# Altium schematic sheet USB_TTL.SchDoc
size A4; SheetNumber: 6; SheetTotal: 6
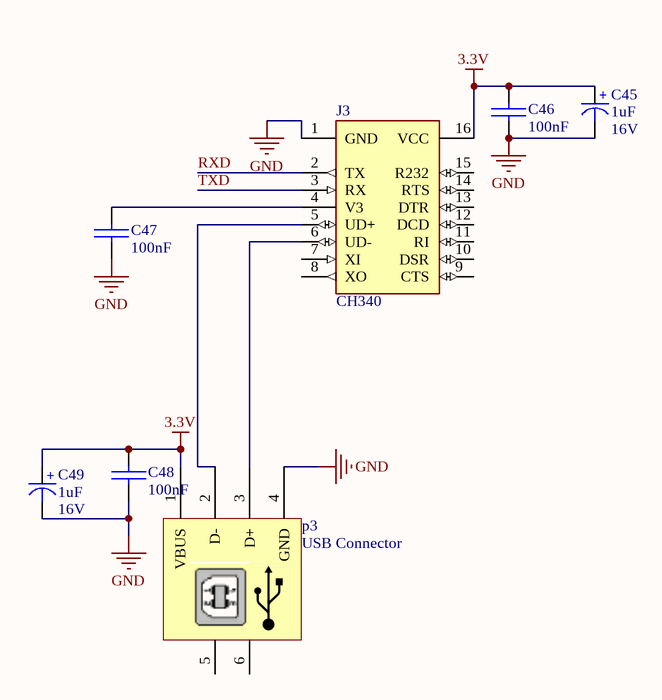
[diagram p0: USB_TTL.SchDoc]

## Parts
C45  Voltage: 16V  [cap 01]  (hidden comment: 1uF)
C46  100nF  [SMD_CAP_1206]
C47  100nF  [SMD_CAP_1206]
C48  100nF  [SMD_CAP_1206]
C49  Voltage: 16V  [cap 01]  (hidden comment: 1uF)
J3  CH340  [SOIC16]
p3  USB Connector  [USB2.5-2H4F]

## Nets
3.3V: C45.1(+) C46.1(+) C48.1(+) C49.1(+) J3.16(VCC) p3.1(VBUS)
GND: C45.2(-) C46.2(-) C47.2(-) C48.2(-) C49.2(-) J3.1(GND) p3.4(GND)
RXD: J3.2(TX)
TXD: J3.3(RX)
NetC47_1: C47.1(+) J3.4(V3)
NetJ3_5: J3.5(UD+) p3.2(D-)
NetJ3_6: J3.6(UD-) p3.3(D+)

Not connected (* = marked no-connect by the designer): J3 7(XI) 8(XO) 9(CTS) 10(DSR) 11(RI) 12(DCD) 13(DTR) 14(RTS) 15(R232); p3 5 6

## Library data of the parts
C45 C49 = Cap-Polar: Polar Capacitor; Designer: Saeid Jorablo; Organazation: ControTec; Adding Date: 1387/12/20; Value: 1uF
C46-C48 = Cap-Bipolar: Bipolar Capacitor; Voltage: 100V; Designer: Saeid Jorablo; Organazation: ControTec; Adding Date: 1387/12/20; Value: 100nF
J3 = CH340: CH340G USB 2.0 to UART (RS232/RS422/RS485) Bridge Interface Evaluation Board; MF: DFRobot; SnapEDA_Link: https://www.snapeda.com/parts/CH340/DFRobot/view-part/?ref=snap; Package: None; Value: *; MP: CH340; Check_prices: https://www.snapeda.com/parts/CH340/DFRobot/view-part/?ref=eda
p3 = USB: USB Connector-B Type; Designer: Eng. Saeid Jorablo; Company: DASE Co; Adding Date: 10/26/2010